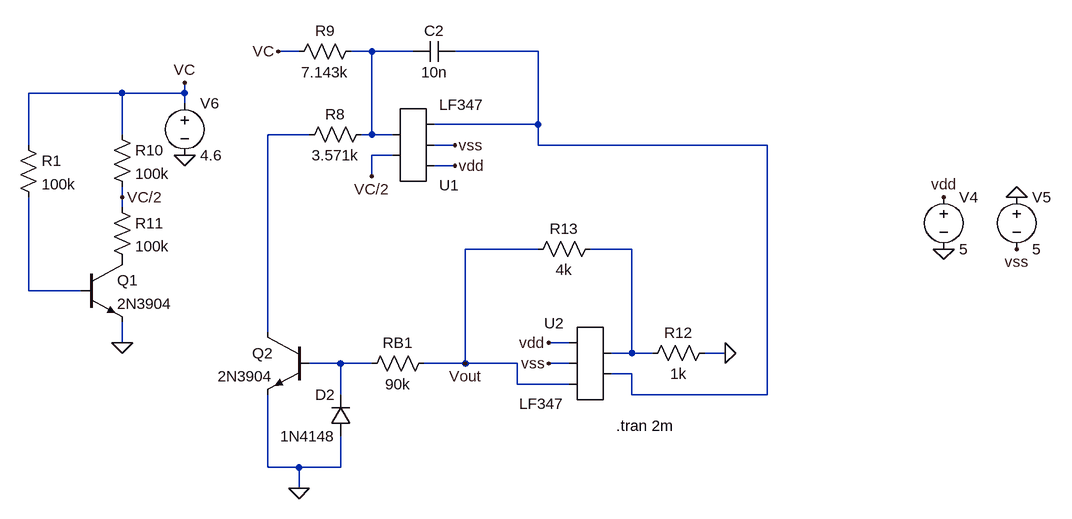
[diagram p0: schematic AnalogEx5_3.asc]
AnalogEx5_3.asc, the LTspice schematic file:
Version 4
SHEET 1 880 724
WIRE -1584 -112 -1616 -112
WIRE -1472 -112 -1504 -112
WIRE -1408 -112 -1472 -112
WIRE -1216 -112 -1344 -112
WIRE -1856 -48 -2000 -48
WIRE -1760 -48 -1760 -64
WIRE -1760 -48 -1856 -48
WIRE -1760 -32 -1760 -48
WIRE -1216 0 -1216 -112
WIRE -1216 0 -1376 0
WIRE -1856 16 -1856 -48
WIRE -1568 16 -1632 16
WIRE -1472 16 -1472 -112
WIRE -1472 16 -1488 16
WIRE -1440 16 -1472 16
WIRE -2000 32 -2000 -48
WIRE -1344 32 -1376 32
WIRE -1216 32 -1216 0
WIRE -864 32 -1216 32
WIRE -1440 48 -1472 48
WIRE -1344 64 -1376 64
WIRE -1472 80 -1472 48
WIRE -1856 112 -1856 96
WIRE -1856 128 -1856 112
WIRE -1216 192 -1328 192
WIRE -1072 192 -1136 192
WIRE -2000 256 -2000 112
WIRE -1920 256 -2000 256
WIRE -1632 320 -1632 16
WIRE -1856 336 -1856 304
WIRE -1168 336 -1200 336
WIRE -1072 352 -1072 192
WIRE -1072 352 -1104 352
WIRE -1040 352 -1072 352
WIRE -928 352 -960 352
WIRE -1520 368 -1568 368
WIRE -1472 368 -1520 368
WIRE -1328 368 -1328 192
WIRE -1328 368 -1392 368
WIRE -1248 368 -1328 368
WIRE -1168 368 -1200 368
WIRE -1072 384 -1104 384
WIRE -1248 400 -1248 368
WIRE -1168 400 -1248 400
WIRE -1520 416 -1520 368
WIRE -1072 416 -1072 384
WIRE -864 416 -864 32
WIRE -864 416 -1072 416
WIRE -1632 528 -1632 416
WIRE -1584 528 -1632 528
WIRE -1520 528 -1520 480
WIRE -1520 528 -1584 528
WIRE -1584 560 -1584 528
FLAG -1344 64 vdd
FLAG -1344 32 vss
FLAG -592 192 0
FLAG -480 112 0
FLAG -592 112 vdd
FLAG -480 192 vss
FLAG -1760 48 0
FLAG -1616 -112 VC
FLAG -1760 -64 VC
FLAG -1856 112 VC/2
FLAG -1472 80 VC/2
FLAG -1584 560 0
FLAG -1200 336 vdd
FLAG -1200 368 vss
FLAG -928 352 0
FLAG -1328 368 Vout
FLAG -1856 336 0
SYMBOL cap -1344 -128 R90
WINDOW 0 0 32 VBottom 2
WINDOW 3 32 32 VTop 2
SYMATTR InstName C2
SYMATTR Value 10n
SYMBOL res -1472 0 R90
WINDOW 0 0 56 VBottom 2
WINDOW 3 32 56 VTop 2
SYMATTR InstName R8
SYMATTR Value 3.571k
SYMBOL voltage -592 96 R0
SYMATTR InstName V4
SYMATTR Value 5
SYMBOL voltage -480 96 R0
SYMATTR InstName V5
SYMATTR Value 5
SYMBOL voltage -1760 -48 R0
WINDOW 123 0 0 Left 0
WINDOW 39 0 0 Left 0
SYMATTR InstName V6
SYMATTR Value 4.6
SYMBOL res -1488 -128 R90
WINDOW 0 0 56 VBottom 2
WINDOW 3 32 56 VTop 2
SYMATTR InstName R9
SYMATTR Value 7.143k
SYMBOL res -1872 0 R0
SYMATTR InstName R10
SYMATTR Value 100k
SYMBOL res -1872 112 R0
SYMATTR InstName R11
SYMATTR Value 100k
SYMBOL diode -1504 480 R180
WINDOW 0 24 64 Left 2
WINDOW 3 24 0 Left 2
SYMATTR InstName D2
SYMATTR Value 1N4148
SYMBOL npn -1568 320 M0
SYMATTR InstName Q2
SYMATTR Value 2N3904
SYMBOL res -1376 352 R90
WINDOW 0 0 56 VBottom 2
WINDOW 3 32 56 VTop 2
SYMATTR InstName RB1
SYMATTR Value 90k
SYMBOL res -944 336 R90
WINDOW 0 0 56 VBottom 2
WINDOW 3 32 56 VTop 2
SYMATTR InstName R12
SYMATTR Value 1k
SYMBOL res -1120 176 R90
WINDOW 0 0 56 VBottom 2
WINDOW 3 32 56 VTop 2
SYMATTR InstName R13
SYMATTR Value 4k
SYMBOL npn -1920 208 R0
SYMATTR InstName Q1
SYMATTR Value 2N3904
SYMBOL res -2016 16 R0
SYMATTR InstName R1
SYMATTR Value 100k
SYMBOL AutoGenerated\\LF347 -1408 32 M180
SYMATTR InstName U1
SYMBOL AutoGenerated\\LF347 -1136 368 M0
SYMATTR InstName U2
TEXT -1096 464 Left 2 !.tran 2m

The netlist it stands for:
* AnalogEx5_3.asc
C2 N002 N001 10n
R8 N001 N003 3.571k
V4 vdd 0 5
V5 0 vss 5
V6 VC 0 4.6
R9 N001 VC 7.143k
R10 VC VC/2 100k
R11 VC/2 P001 100k
D2 0 N006 1N4148
Q2 N003 N006 0 0 2N3904
RB1 Vout N006 90k
R12 0 N004 1k
R13 N004 Vout 4k
Q1 P001 N005 0 0 2N3904
R1 VC N005 100k
* U1: LF347 (symbol AutoGenerated\LF347 not available, pins judged from their places): pin1=VC/2 pin2=N001 pin3=vdd pin4=vss pin5=N002
* U2: LF347 (symbol AutoGenerated\LF347 not available, pins judged from their places): pin1=N004 pin2=N002 pin3=vdd pin4=vss pin5=Vout
.model D D
.lib standard.dio
.model NPN NPN
.model PNP PNP
.lib standard.bjt
.tran 2m
.backanno
.end